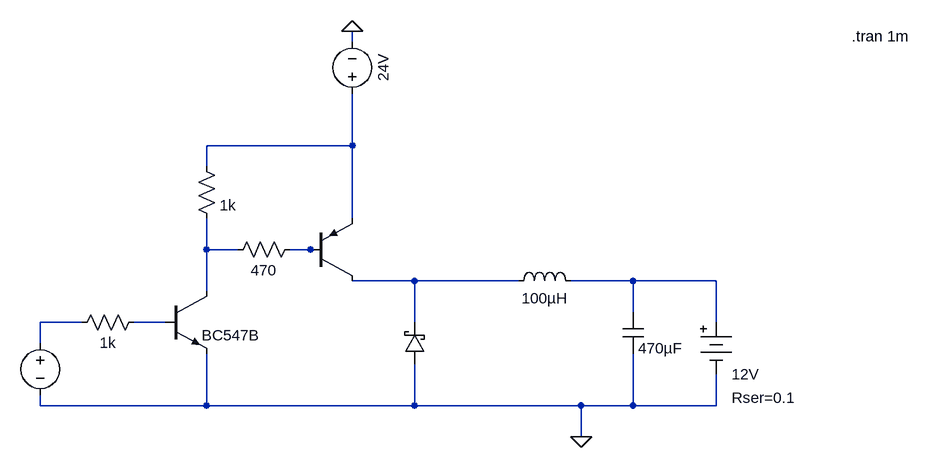
[diagram p0: schematic PNP.asc]
PNP.asc, the LTspice schematic file:
Version 4
SHEET 1 1064 680
WIRE 192 -400 192 -416
WIRE 192 -240 192 -320
WIRE 192 -240 -32 -240
WIRE -32 -208 -32 -240
WIRE 192 -128 192 -240
WIRE -32 -80 -32 -128
WIRE 16 -80 -32 -80
WIRE 128 -80 96 -80
WIRE 144 -80 128 -80
WIRE 288 -32 192 -32
WIRE 448 -32 288 -32
WIRE 624 -32 528 -32
WIRE 752 -32 624 -32
WIRE -32 -16 -32 -80
WIRE 624 16 624 -32
WIRE -224 32 -288 32
WIRE -96 32 -144 32
WIRE 288 32 288 -32
WIRE 752 32 752 -32
WIRE -288 64 -288 32
WIRE -288 160 -288 144
WIRE -32 160 -32 80
WIRE -32 160 -288 160
WIRE 288 160 288 96
WIRE 288 160 -32 160
WIRE 544 160 288 160
WIRE 624 160 624 80
WIRE 624 160 544 160
WIRE 752 160 752 112
WIRE 752 160 624 160
WIRE 544 208 544 160
FLAG 544 208 0
FLAG 192 -416 0
SYMBOL pnp 128 -32 M180
WINDOW 0 84 32 Invisible 2
WINDOW 3 84 68 Invisible 2
SYMATTR InstName Q1
SYMATTR Value 2SAR562F3
SYMBOL voltage 192 -304 R180
WINDOW 0 32 56 Invisible 2
WINDOW 3 -32 56 VBottom 2
WINDOW 123 0 0 Left 0
WINDOW 39 0 0 Left 0
SYMATTR InstName V1
SYMATTR Value 24V
SYMBOL ind 432 -16 R270
WINDOW 0 32 56 Invisible 2
WINDOW 3 5 56 VBottom 2
SYMATTR InstName L1
SYMATTR Value 100µH
SYMBOL cap 608 16 R0
WINDOW 0 24 8 Invisible 2
SYMATTR InstName C1
SYMATTR Value 470µF
SYMBOL Misc\\battery 752 16 R0
WINDOW 0 24 16 Invisible 2
WINDOW 123 0 0 Left 0
WINDOW 39 24 132 Left 2
SYMATTR InstName V2
SYMATTR SpiceLine Rser=0.1
SYMATTR Value 12V
SYMBOL npn -96 -16 R0
WINDOW 0 56 32 Invisible 2
SYMATTR InstName Q2
SYMATTR Value BC547B
SYMBOL res -48 -224 R0
WINDOW 0 36 40 Invisible 2
SYMATTR InstName R1
SYMATTR Value 1k
SYMBOL res 112 -96 R90
WINDOW 0 0 56 Invisible 2
WINDOW 3 32 56 VTop 2
SYMATTR InstName R2
SYMATTR Value 470
SYMBOL res -128 16 R90
WINDOW 0 0 56 Invisible 2
WINDOW 3 32 56 VTop 2
SYMATTR InstName R3
SYMATTR Value 1k
SYMBOL voltage -288 48 R0
WINDOW 0 24 16 Invisible 2
WINDOW 3 -108 139 Invisible 2
WINDOW 123 0 0 Left 0
WINDOW 39 0 0 Left 0
SYMATTR InstName V3
SYMATTR Value PULSE(0 5V 1n 1n 1n 13us 20us)
SYMBOL schottky 304 96 R180
WINDOW 0 24 64 Invisible 2
WINDOW 3 24 0 Invisible 2
SYMATTR InstName D1
SYMATTR Value MBRS340
SYMATTR Description Diode
SYMATTR Type diode
TEXT 960 -408 Left 2 !.tran 1m

The netlist it stands for:
* PNP.asc
Q1 N004 N003 N001 0 2SAR562F3
V1 N001 0 24V
L1 N004 N005 100µH
C1 N005 0 470µF
V2 N005 0 12V Rser=0.1
Q2 N002 N007 0 0 BC547B
R1 N001 N002 1k
R2 N003 N002 470
R3 N007 N006 1k
V3 N006 0 PULSE(0 5V 1n 1n 1n 13us 20us)
D1 0 N004 MBRS340
.model D D
.lib standard.dio
.model NPN NPN
.model PNP PNP
.lib standard.bjt
.tran 1m
.backanno
.end